# Altium schematic sheet E17-PDU-CONNECTORS.SchDoc
size A3
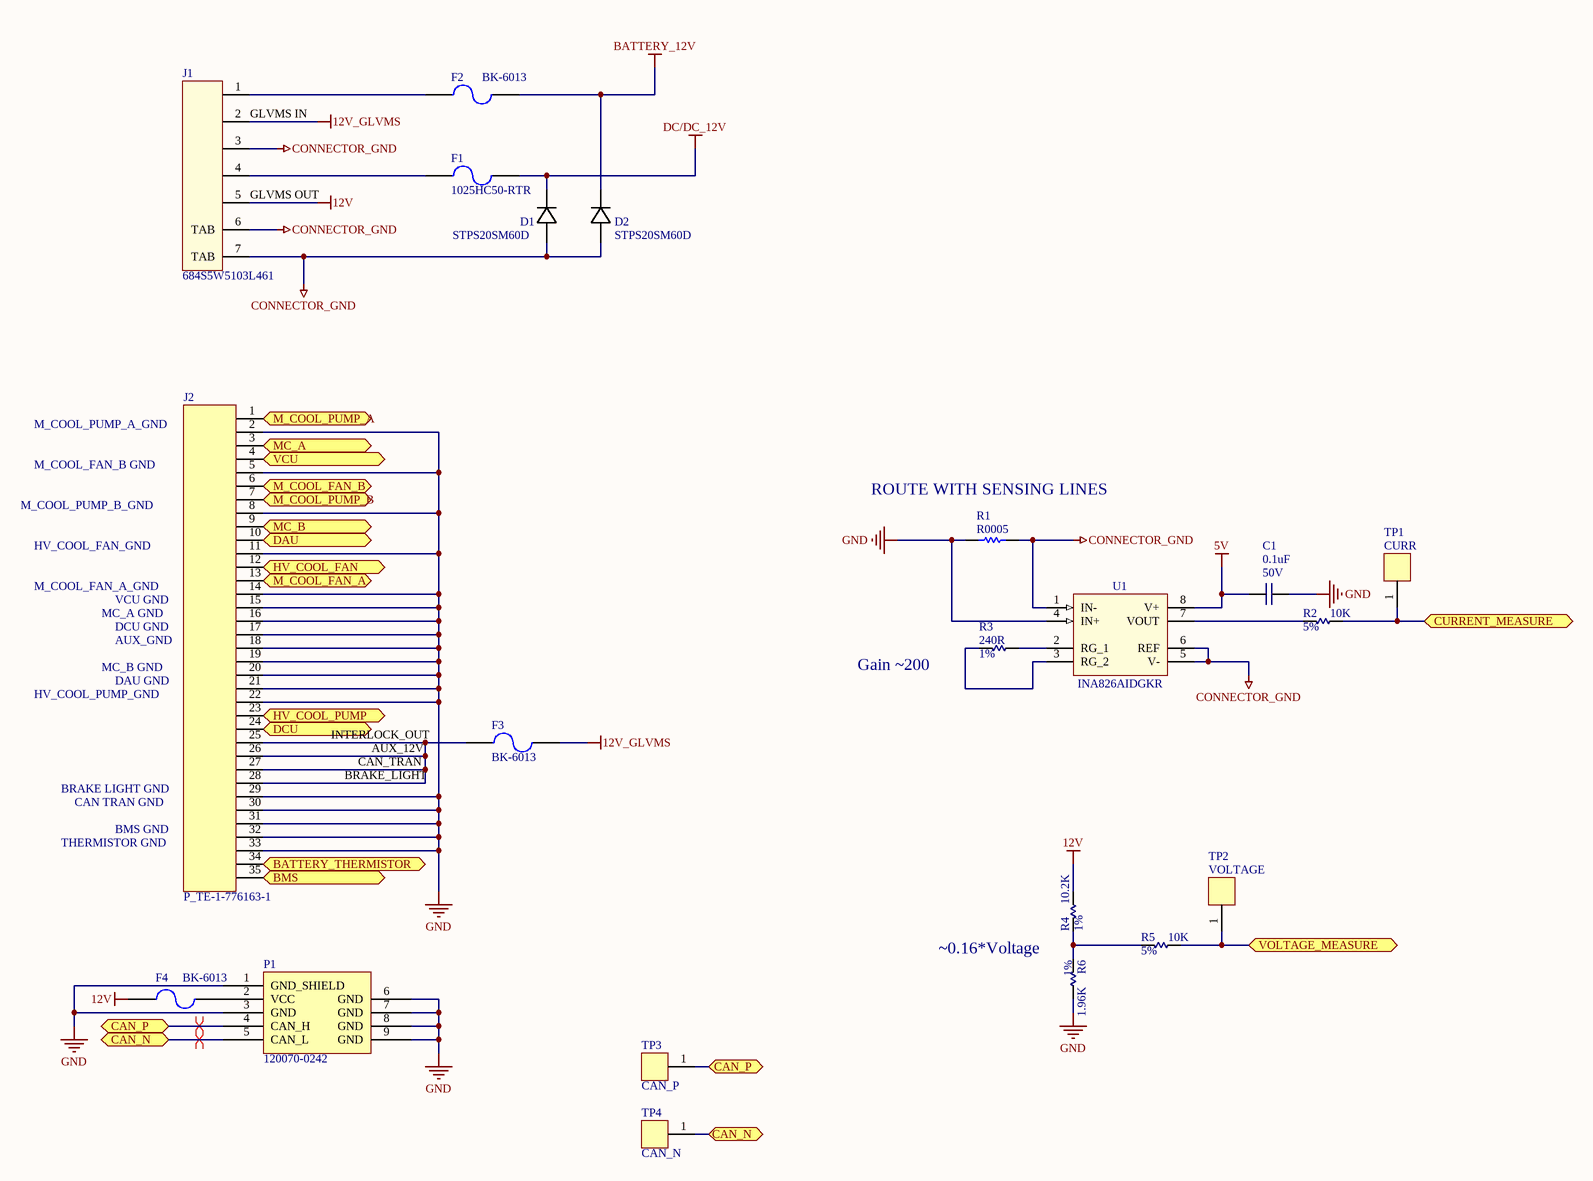
[diagram p0: E17-PDU-CONNECTORS.SchDoc]

## Parts
C1  value 0.1uF  Voltage: 50V  [C0805]  (hidden comment: C_0805_Generic)
D1  MFG_PN: STPS20SM60D  [TO-220-2]  (hidden comment: D_STPS20SM60D)
D2  MFG_PN: STPS20SM60D  [TO-220-2]  (hidden comment: D_STPS20SM60D)
F1  MFG_PN: 1025HC50-RTR  [F_1025HC50-RTR]  (hidden comment: F_1025HC50-RTR)
F2  F_BK-6013  [BK-6013]  (value not drawn)
F3  F_BK-6013  [BK-6013]  (value not drawn)
F4  F_BK-6013  [BK-6013]  (value not drawn)
J1  MFG_PN: 684S5W5103L461  [J_684S5W5103L461]  (hidden comment: J_684S5W5103L461)
J2  P_TE-1-776163-1  [P_TE-1-776163-1]
P1  MFG_PN: 120070-0242  [CAN Connector (90)]  (hidden comment: P_CAN-CONNECTOR)
R1  value R0005  [PSR500HTQFC0L20]  (hidden comment: R_PSR500HTQFC0L20)
R2  value 10K  Tolerance: 5%  [R0805]  (hidden comment: R_0805_Generic)
R3  value 240R  Tolerance: 1%  [R0805]  (hidden comment: R_0805_Generic)
R4  value 10.2K  Tolerance: 1%  [R0805]  (hidden comment: R_0805_Generic)
R5  value 10K  Tolerance: 5%  [R0805]  (hidden comment: R_0805_Generic)
R6  value 1.96K  Tolerance: 1%  [R0805]  (hidden comment: R_0805_Generic)
TP1  CURR  [TEST POINT]
TP2  VOLTAGE  [TEST POINT]
TP3  CAN_P  [TEST POINT]
TP4  CAN_N  [TEST POINT]
U1  value INA826AIDGKR  [8-TSSOP]  (hidden comment: U_INA826AIDGKR)

## Ports
BATTERY_THERMISTOR, BMS, CAN_N, CAN_P, CURRENT_MEASURE, DAU, DCU, HV_COOL_FAN, HV_COOL_PUMP, M_COOL_FAN_A, M_COOL_FAN_B, M_COOL_PUMP_A, M_COOL_PUMP_B, MC_A, MC_B, VCU, VOLTAGE_MEASURE

## Nets
5V: C1.2 U1.8(V+)
12V: F4.2 J1.5 R4.2
12V_GLVMS: F3.2 J1.2
BATTERY_12V: D2.2 F2.2
CONNECTOR_GND: D1.1 D2.1 J1.3 J1.6(TAB) J1.7(TAB) R1.2 U1.1(IN-) U1.5(V-) U1.6(REF)
DC/DC_12V: D1.2 F1.2
GND: C1.1(EGND) J2.2 J2.5 J2.8 J2.11 J2.14 J2.15 J2.16 J2.17 J2.18 J2.19 J2.20 J2.21 J2.22 J2.29 J2.30 J2.31 J2.32 J2.33 P1.1(GND_SHIELD) P1.3(GND) P1.6(GND) P1.7(GND) P1.8(GND) P1.9(GND) R1.1 R6.2 U1.4(IN+)
BATTERY_THERMISTOR: J2.34 ; port BATTERY_THERMISTOR
BMS: J2.35 ; port BMS
CAN_N: P1.5(CAN_L) TP4.1 ; port CAN_N
CAN_P: P1.4(CAN_H) TP3.1 ; port CAN_P
CURRENT_MEASURE: R2.2 TP1.1 ; port CURRENT_MEASURE
DAU: J2.10 ; port DAU
DCU: J2.24 ; port DCU
HV_COOL_FAN: J2.12 ; port HV_COOL_FAN
HV_COOL_PUMP: J2.23 ; port HV_COOL_PUMP
M_COOL_FAN_A: J2.13 ; port M_COOL_FAN_A
M_COOL_FAN_B: J2.6 ; port M_COOL_FAN_B
M_COOL_PUMP_A: J2.1 ; port M_COOL_PUMP_A
M_COOL_PUMP_B: J2.7 ; port M_COOL_PUMP_B
MC_A: J2.3 ; port MC_A
MC_B: J2.9 ; port MC_B
VCU: J2.4 ; port VCU
VOLTAGE_MEASURE: R5.2 TP2.1 ; port VOLTAGE_MEASURE
NetF1_1: F1.1 J1.4
NetF2_1: F2.1 J1.1
NetF3_1: F3.1 J2.25 J2.26 J2.27 J2.28
NetF4_1: F4.1 P1.2(VCC)
NetR2_1: R2.1 U1.7(VOUT)
NetR3_1: R3.1 U1.3(RG_2)
NetR3_2: R3.2 U1.2(RG_1)
NetR4_1: R4.1 R5.1 R6.1

## Layout directives
differential pair: CAN_N, CAN_P

## Notes on the sheet
- (near J1) GLVMS IN
- (near J1) GLVMS OUT
- M_COOL_FAN_B GND
- M_COOL_PUMP_A_GND
- M_COOL_PUMP_B_GND
- (near R1) ROUTE WITH SENSING LINES
- HV_COOL_FAN_GND
- M_COOL_FAN_A_GND
- VCU GND
- MC_A GND
- MC_B GND
- DCU GND
- AUX_GND
- Gain ~200
- HV_COOL_PUMP_GND
- DAU GND
- INTERLOCK_OUT
- BRAKE LIGHT GND
- CAN TRAN GND
- BRAKE_LIGHT
- CAN_TRAN
- AUX_12V
- THERMISTOR GND
- BMS GND
- ~0.16*Voltage

## Library data of the parts
C1 = C_0805_Generic: Generic 0805 Capacitor; Tolerance: 10%; Supplier: Digikey; Supplier_PN: 399-1170-1-ND
D1 D2 = D_STPS20SM60D: DIODE 630mV 20A cts 60V; MFG: ST; Supplier: Digikey; Supplier_PN: 497-12305-ND
F1 = F_1025HC50-RTR: FUSE 50A 60VDC; MFG: Eaton; Supplier: Digikey; Supplier_PN: 283-4682-1-ND
F2-F4 = F_BK-6013: FUSE HOLDER BLADE PCB; MFG: MPD; Supplier: Digikey; Supplier_PN: BK-6013-ND; MFG_PN: BK-6013
J1 = J_684S5W5103L461: D-Sub 5-pin 40A RA TH; MFG: NorComp; Supplier: Digikey; Supplier_PN: NOR1213-ND
J2 = P_TE-1-776163-1: CONN HEADER 35POS R/A GOLD BLACK; MFG: TE; Supplier_PN: A106383-ND; Supplier: Digikey; MFG_PN: 1-776163-1
P1 = P_CAN-CONNECTOR: MFG: MOLEX
R1 = R_PSR500HTQFC0L20: Resistor 0.0002ohm 5W Current Sense; MFG: Rohm; MFG_PN: PSR500HTQFC0L20; Supplier: Digikey; Supplier_PN: RHM1679-CT-ND
R2-R6 = R_0805_Generic: Generic 0805 Resistor; Power: 1/8W; Supplier: Digikey
  R2 R5: Supplier_PN: P10KACT-ND
  R3: Supplier_PN: P240CCT-ND
  R4: Supplier_PN: P10.2KCCT-ND
  R6: Supplier_PN: P1.96KCCT-ND
TP1-TP4 = Test Point
U1 = U_INA826AIDGKR: Opamp Instrumentation 2.7-36V SS; MFG: TI; MFG_PN: INA826AIDGKR; Supplier 1: Digi-Key; Supplier Part Number 1: 296-29663-1-ND